# Altium project mind_Project_1.PrjPcb
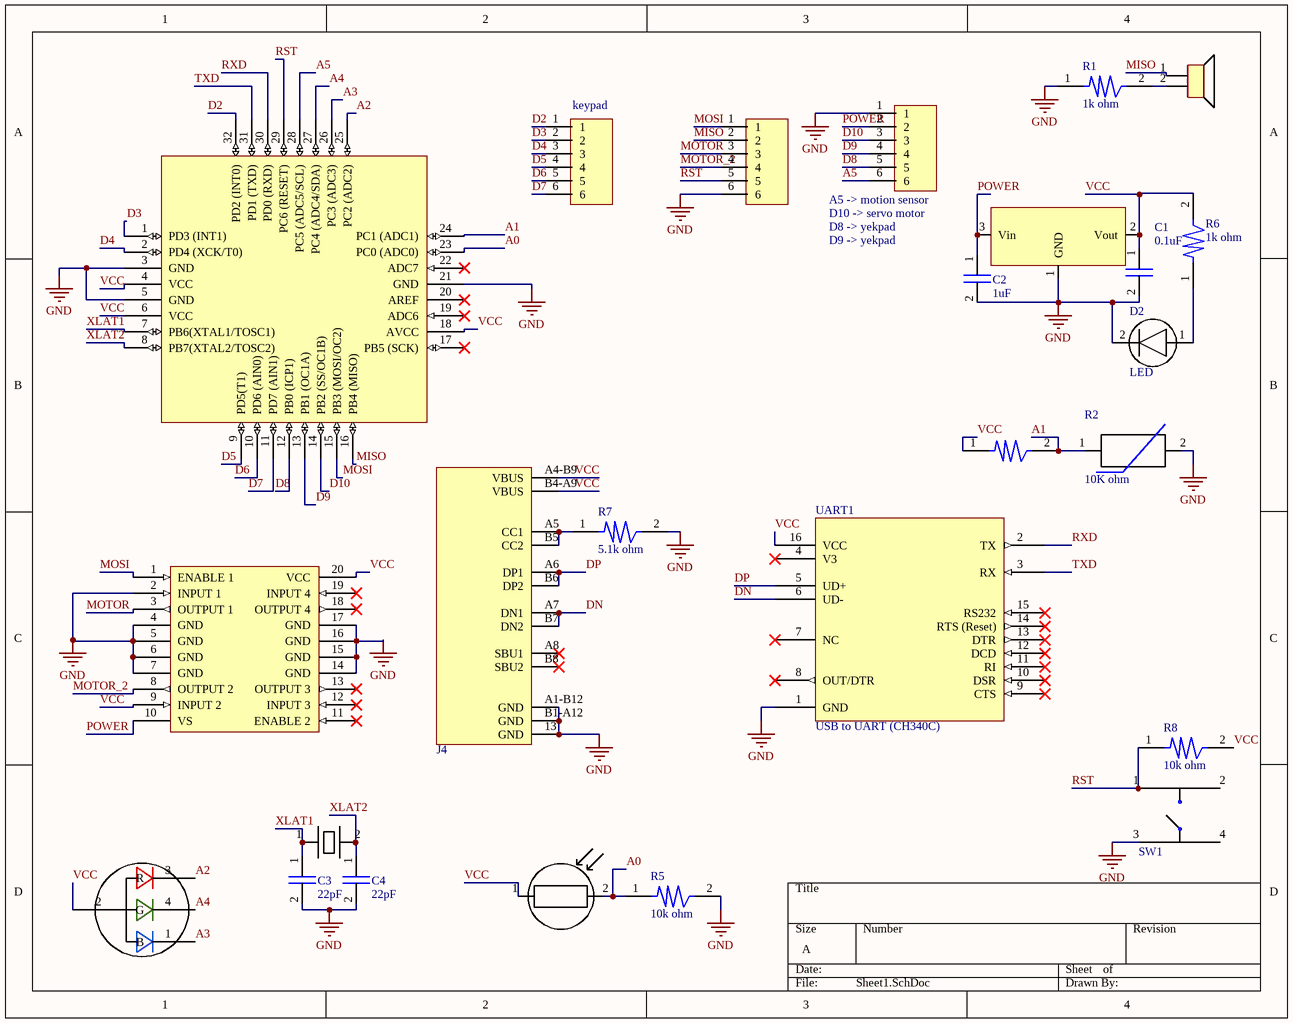
[diagram p0: Sheet1.SchDoc]
1 sheet, 25 parts. Net scope: global (net labels, ports and power ports of the same name join across sheets).
Board file: PCB1.PcbDoc

## Sheet Sheet1.SchDoc
size A; SheetNumber: 1; SheetTotal: 1

### Parts
BUZ1  Buzzer  [Buzzer]  (value not drawn)
C1  0.1uF  [Capacitor 0603 SMD]
C2  1uF  [Capacitor 0603 SMD]
C3  22pF  [Capacitor 0603 SMD]
C4  22pF  [Capacitor 0603 SMD]
D1  RGB  [RGB]  (value not drawn)
D2  LED  [LED]
J1  6P 2mm Pin Headers  [6P 2mm Pin header]  (value not drawn)
J2  6P 2mm Pin Headers  [6P 2mm Pin header]  (value not drawn)
J3  6P 2mm Pin Headers  [6P 2mm Pin header]  (value not drawn)
J4  TYPE-C-31-M-12  [USB TYPE C-31-M-12]  (value not drawn)
R1  1k ohm  [Resistor 0603 SMD]
R2  10K ohm  [Resistor 0603 SMD]
R3  10k ohm  [Resistor 0603 SMD]  (value not drawn)
R4  Photoresistors 8kΩ~20kΩ  [Photoresistor GL5528]  (value not drawn)
R5  10k ohm  [Resistor 0603 SMD]
R6  1k ohm  [Resistor 0603 SMD]
R7  5.1k ohm  [Resistor 0603 SMD]
R8  10k ohm  [Resistor 0603 SMD]
SW1  Tact Switch  [Tact Switch]  (value not drawn)
U1  Motor_Driver  [L293D]  (value not drawn)
U2  ATmega 8A  [ATmega 8A]  (value not drawn)
UART1  USB to UART (CH340C)  [(USB-UART) CH340C]
VR1  Regulator 5V  [Regulator 5V AMS1117]  (value not drawn)
Y1  Crystal 16Mhz  [Crystal 16Mhz]  (value not drawn)

### Nets
GND: C1.2 C2.2 C3.2 C4.2 D2.2 J1.1 J2.6 J4.13(GND) J4.A1-B12(GND) J4.B1-A12(GND) R1.1 R2.2 R5.2 R7.2 SW1.3 U1.2(INPUT_1) U1.4(GND) U1.5(GND) U1.6(GND) U1.7(GND) U1.14(GND) U1.15(GND) U1.16(GND) U1.17(GND) U2.3(GND) U2.5(GND) U2.21(GND) UART1.1(GND) VR1.1(GND)
A0: R4.2 R5.1 U2.23(PC0_(ADC0))
A1: R2.1 R3.2 U2.24(PC1_(ADC1))
A2: D1.3(R) U2.25(PC2_(ADC2))
A3: D1.1(B) U2.26(PC3_(ADC3))
A4: D1.4(G) U2.27(PC4_(ADC4/SDA))
A5: J1.6 U2.28(PC5_(ADC5/SCL))
D2: J3.1 U2.32(PD2_(INT0))
D3: J3.2 U2.1(PD3_(INT1))
D4: J3.3 U2.2(PD4_(XCK/T0))
D5: J3.4 U2.9(PD5(T1))
D6: J3.5 U2.10(PD6_(AIN0))
D7: J3.6 U2.11(PD7_(AIN1))
D8: J1.5 U2.12(PB0_(ICP1))
D9: J1.4 U2.13(PB1_(OC1A))
D10: J1.3 U2.14(PB2_(SS/OC1B))
DN: J4.A7(DN1) J4.B7(DN2) UART1.6(UD-)
DP: J4.A6(DP1) J4.B6(DP2) UART1.5(UD+)
MISO: BUZ1.1 J2.2 U2.16(PB4_(MISO))
MOSI: J2.1 U1.1(ENABLE_1) U2.15(PB3_(MOSI/OC2))
MOTOR: J2.3 U1.3(OUTPUT_1)
MOTOR_2: J2.4 U1.8(OUTPUT_2)
POWER: C2.1 J1.2 U1.10(VS) VR1.3(Vin)
RST: J2.5 R8.1 SW1.1 U2.29(PC6_(RESET))
RXD: U2.30(PD0_(RXD)) UART1.2(TX)
TXD: U2.31(PD1_(TXD)) UART1.3(RX)
VCC: C1.1 D1.2(Anode) J4.A4-B9(VBUS) J4.B4-A9(VBUS) R3.1 R4.1 R6.2 R8.2 U1.9(INPUT_2) U1.20(VCC) U2.4(VCC) U2.6(VCC) U2.18(AVCC) UART1.16(VCC) VR1.2(Vout)
XLAT1: C3.1 U2.7(PB6(XTAL1/TOSC1)) Y1.1
XLAT2: C4.1 U2.8(PB7(XTAL2/TOSC2)) Y1.2
NetBUZ1_2: BUZ1.2 R1.2
NetD2_1: D2.1 R6.1
NetJ4_A5: J4.A5(CC1) J4.B5(CC2) R7.1

Not connected (* = marked no-connect by the designer): J4 A8(SBU1)* B8(SBU2)*; SW1 2 4; U1 11(ENABLE_2)* 12(INPUT_3)* 13(OUTPUT_3)* 18(OUTPUT_4)* 19(INPUT_4)*; U2 17(PB5_(SCK))* 19(ADC6)* 20(AREF)* 22(ADC7)*; UART1 4(V3)* 7(NC)* 8(OUT/DTR)* 9(CTS)* 10(DSR)* 11(RI)* 12(DCD)* 13(DTR)* 14(RTS_(Reset))* 15(RS232)*

### Notes on the sheet
- (near J3) keypad
- (near J1) A5 -> motion sensor
- (near J1) D10 -> servo motor
- (near J1) D8 -> yekpad
- D9 -> yekpad

### Library data of the parts
BUZ1 = Buzzer: BUZZER PIEZO 1.5V 12X12MM SMD / Buzzers Transducer, Externally Driven Piezo 1.5 V 4kHz 84dB @ 1.5V, 10cm Surface Mount Solder Pads; Manufacturer: Murata Electronics; Manufacturer Product Number: PKLCS1212E4001-R1; Supplier: DigiKey; Supplier Part Number: 490-4683-2-ND - Tape & Reel (TR)
C1 = Capacitor 0.1uF: 50V 100nF X7R ±10% 0603 Multilayer Ceramic Capacitors MLCC - SMD/SMT ROHS; Manufacturer: YAGEO; Manufacturer Product Number: CC0603KRX7R9BB104; Supplier: LCSC; Supplier Part Number: C14663
C2 = Capacitor 1uF: 16V 1uF X5R ±10% 0603 Multilayer Ceramic Capacitors MLCC - SMD/SMT ROHS; Manufacturer: Samsung Electro-Mechanics; Manufacturer Product Number: CL10A105KO8NNNC; Supplier: LCSC; Supplier Part Number: C1592
C3 C4 = Capacitor 22pF: 50V 22pF NP0 ±5% 0603 Multilayer Ceramic Capacitors MLCC - SMD/SMT ROHS; Manufacturer: YAGEO; Manufacturer Product Number: CC0603JRNPO9BN220; Supplier: LCSC; Supplier Part Number: C105620
D1 = RGB: SMD,1.5x3mm RGB LEDs ROHS; manufacturer: MEIHUA; Mfr. Part #: MHS110RGBCT; supplier: LCSC; supplier Part #: C389528
D2 = LED: 360mcd 515nm~530nm Emerald 1206 LED Indication - Discrete ROHS; manufacturer: Everlight Elec; Mfr. Part #: 15-21/GHC-XS1T1/3T; supplier: LCSC; supplier Part #: C2984261
J1-J3 = 6P 2mm Pin Headers: Connector Header Through Hole 6 position 0.079" (2.00mm); Manufacturer: TE Connectivity AMP Connectors; Manufacturer Part Number: 2355172-6; Supplier: DigiKey; Supplier Part Number: 17-2355172-6-ND
J4 = TYPE-C-31-M-12: 5A 1 16P Female Type-C SMD USB Connectors ROHS; Manufacturer: Korean Hroparts Elec; Manufacturer Product Number: TYPE-C-31-M-12; Supplier: LCSC; Supplier Part Number: C165948
R1 R6 = Resistor 1k Ohm: 100mW Thick Film Resistors 75V ±100ppm/℃ ±1% 1kΩ 0603 Chip Resistor - Surface Mount ROHS; Manufacturer: UNI-ROYAL(Uniroyal Elec); Manufacturer Product Number: 0603WAF1001T5E; Supplier: LCSC; Supplier Part Number: C21190
R2 = NTC Thermo (ERT-J1VR103J): THERMISTOR NTC 10KOHM 4250K 0603; Manufacturer: Panasonic Electronic Components; Manufacturer Product Number: ERT-J1VR103J; Supplier: DigiKey; Supplier Part Number: P10547TR-ND - Tape & Reel (TR)
R3 R5 R8 = Resistor 10k Ohm: 100mW Thick Film Resistors 75V ±100ppm/℃ ±1% 10kΩ 0603 Chip Resistor - Surface Mount ROHS; Manufacturer: UNI-ROYAL(Uniroyal Elec); Manufacturer Product Number: 0603WAF1002T5E; Supplier: LCSC; Supplier Part Number: C25804
R4 = Photoresistors 8kΩ~20kΩ: 8kΩ~20kΩ 540nm 1MΩ Plugin,P=3mm Photoresistors ROHS; Manufacturer: Senba Sensing Tech; Manufacturer Product Number: GL5528; Supplier: LCSC; Supplier Part Number: C125627
R7 = Resistor 5.1k Ohm: 100mW Thick Film Resistors 75V ±100ppm/℃ ±1% 5.1kΩ 0603 Chip Resistor - Surface Mount ROHS; Manufacturer: UNI-ROYAL(Uniroyal Elec); Manufacturer Product Number: 0603WAF5101T5E; Supplier: LCSC; Supplier Part Number: C23186
SW1 = Tact Switch: SWITCH TACTILE SPST-NO 0.05A 12V / Tactile Switch SPST-NO Top Actuated Surface Mount; Manufacturer: C&K; Manufacturer Product Number: PTS 647 SN50 SMTR2 LFS; Supplier: DigiKey; Supplier Part Number: PTS647SN50SMTR2LFSTR-ND - Tape & Reel (TR)
U1 = L293D: SOIC-20-300mil Stepper Motor Driver ROHS; manufacturer: STMicroelectronics; Mfr. Part #: L293DD013TR; supplier: LCSC; supplier Part #: C21610
U2 = ATmega 8A: 8KB 1KB FLASH 23 2.7V~5.5V AVR 16MHz TQFP-32(7x7) Microcontrollers (MCU/MPU/SOC) ROHS; manufacturer: Microchip Tech; Mfr. Part #: ATMEGA8A-AU; supplier: LCSC; supplier Part #: C16190
UART1 = USB to UART (CH340C): 2Mbps Transceiver USB 2.0 SOP-16 USB Converters ROHS; Manufacturer: WCH(Jiangsu Qin Heng); Manufacturer Product Number: CH340C; Supplier: LCSC; Supplier Part Number: C84681
VR1 = Regulator 5V: 1A Fixed 5V Positive electrode 18V SOT-89 Voltage Regulators - Linear, Low Drop Out (LDO) Regulators ROHS; Manufacturer: MSKSEMI; Manufacturer Product Number: AMS1117-5.0V; Supplier: LCSC; Supplier Part Number: C7473143
Y1 = Crystal 16Mhz: 16 MHz ±30ppm Crystal 20pF 50 Ohms HC-49/US; Manufacturer: ECS Inc.; Manufacturer Product Number: ECS-160-20-3X-TR; Supplier: DigiKey; Supplier Part Number: XC1776TR-ND - Tape & Reel (TR)